# EasyEDA Pro project Cockcroft_Walton PCB.epro

# Board PCB1
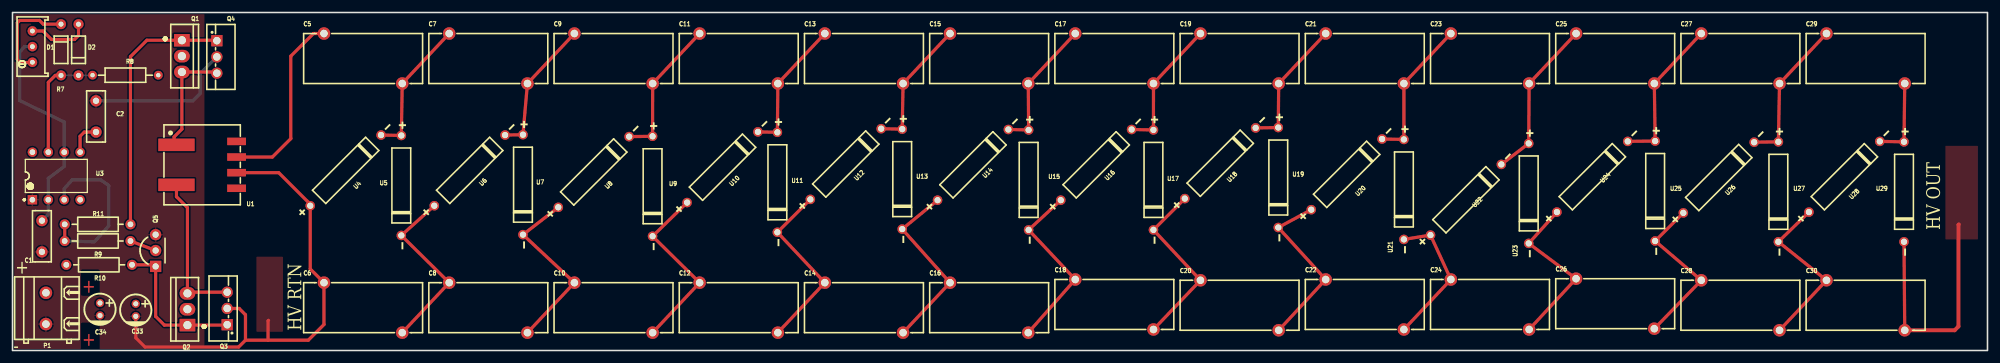
[diagram p0: board, top side]
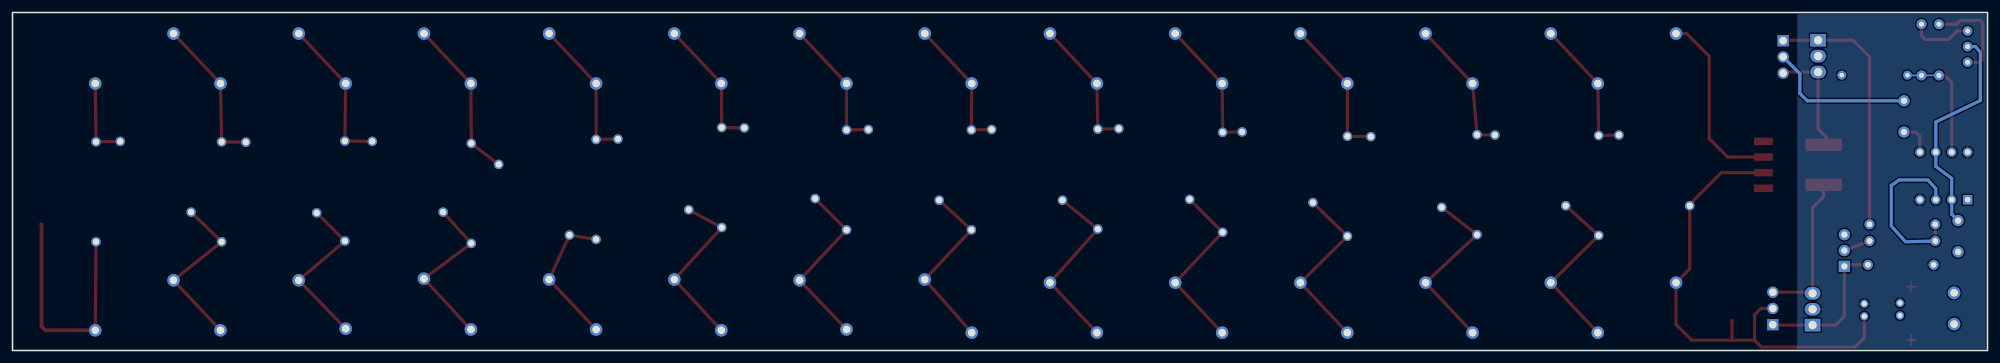
[diagram p1: board, bottom side, seen from below]

Outline 315.47 x 54.1 mm; copper layers: Top Layer, Bottom Layer. Coordinates in mm from the lower left corner of the outline.
Outline path: rectangle 0,54.1 315.47,0
Stack: Top Layer 0.035mm / Dielectric1 1.51mm FR4 er 4.5 / Bottom Layer 0.035mm

## Design rules (mm)
template: JLCPCB Capability(Two Layers Board)
spacing copperThickness1oz (default): track to track 0.102, other pairs 0.152 to 0.3
spacing copperThickness2oz: track to track 0.203, other pairs 0.152 to 0.3
track width copperThickness1oz (default): min 0.127, default 0.254, max 2.54
track width copperThickness2oz: min 0.203, default 0.254, max 2.54
differential pair differentialPair (default): width min 0.127, default 0.254, max 2.54; gap min 0.152, default 0.152
via viaSize (default): diameter min 0.5, default 0.61, max 10; hole min 0.3, default 0.305, max 6.3

## Placement (name value [footprint] x y rotation side)
C1  1nF  [CAP-TH_L8.0-W3.0-P5.0-D0.60]  4.7 18.29 90 top
C2  1nF  [CAP-TH_L8.0-W3.0-P5.0-D0.60]  13.34 37.47 270 top
C5  2nF  [CAP-TH_L19.0-W8.0-P12.50-D0.8-S8.0]  56 46.74 0 top
C6  2nF  [CAP-TH_L19.0-W8.0-P12.50-D0.8-S8.0]  56 6.86 0 top
C7  2nF  [CAP-TH_L19.0-W8.0-P12.50-D0.8-S8.0]  76 46.74 0 top
C8  2nF  [CAP-TH_L19.0-W8.0-P12.50-D0.8-S8.0]  76 6.86 0 top
C9  2nF  [CAP-TH_L19.0-W8.0-P12.50-D0.8-S8.0]  96 46.74 0 top
C10  2nF  [CAP-TH_L19.0-W8.0-P12.50-D0.8-S8.0]  96 6.86 0 top
C11  2nF  [CAP-TH_L19.0-W8.0-P12.50-D0.8-S8.0]  116 46.74 0 top
C12  2nF  [CAP-TH_L19.0-W8.0-P12.50-D0.8-S8.0]  116 6.86 0 top
C13  2nF  [CAP-TH_L19.0-W8.0-P12.50-D0.8-S8.0]  136 46.74 0 top
C14  2nF  [CAP-TH_L19.0-W8.0-P12.50-D0.8-S8.0]  136 6.86 0 top
C15  2nF  [CAP-TH_L19.0-W8.0-P12.50-D0.8-S8.0]  156 46.74 0 top
C16  2nF  [CAP-TH_L19.0-W8.0-P12.50-D0.8-S8.0]  156 6.86 0 top
C17  2nF  [CAP-TH_L19.0-W8.0-P12.50-D0.8-S8.0]  176 46.74 0 top
C18  2nF  [CAP-TH_L19.0-W8.0-P12.50-D0.8-S8.0]  176 7.37 0 top
C19  2nF  [CAP-TH_L19.0-W8.0-P12.50-D0.8-S8.0]  196 46.74 0 top
C20  2nF  [CAP-TH_L19.0-W8.0-P12.50-D0.8-S8.0]  196 7.24 0 top
C21  2nF  [CAP-TH_L19.0-W8.0-P12.50-D0.8-S8.0]  216 46.74 0 top
C22  2nF  [CAP-TH_L19.0-W8.0-P12.50-D0.8-S8.0]  216 7.37 0 top
C23  2nF  [CAP-TH_L19.0-W8.0-P12.50-D0.8-S8.0]  236 46.74 0 top
C24  2nF  [CAP-TH_L19.0-W8.0-P12.50-D0.8-S8.0]  236 7.37 0 top
C25  2nF  [CAP-TH_L19.0-W8.0-P12.50-D0.8-S8.0]  256 46.74 0 top
C26  2nF  [CAP-TH_L19.0-W8.0-P12.50-D0.8-S8.0]  256 7.49 0 top
C27  2nF  [CAP-TH_L19.0-W8.0-P12.50-D0.8-S8.0]  276 46.74 0 top
C28  2nF  [CAP-TH_L19.0-W8.0-P12.50-D0.8-S8.0]  276 7.24 0 top
C29  2nF  [CAP-TH_L19.0-W8.0-P12.50-D0.8-S8.0]  296 46.74 0 top
C30  2nF  [CAP-TH_L19.0-W8.0-P12.50-D0.8-S8.0]  296 7.24 0 top
C33  22uF  [CAP-TH_BD5.0-P2.00-D0.8-FD]  19.69 6.48 270 top
C34  22uF  [CAP-TH_BD5.0-P2.00-D0.8-FD]  13.97 6.6 270 top
D1  1N4148  [DO-35_BD2.0-L4.2-P8.20-D0.5-RD]  7.75 48.13 270 top
D2  1N4148  [DO-35_BD2.0-L4.2-P8.20-D0.5-RD]  10.54 48.13 90 top
P1  WJ128V-5.0-2P  [CONN-TH_2P-P5.00_WJ128V-5.0-2P]  5.33 6.73 90 top
Q1  TIP41C  [TO-220-3_L10.0-W4.5-P2.54-T]  27.05 47.12 0 top
Q2  TIP41C  [TO-220-3_L10.0-W4.5-P2.54-T]  27.94 6.6 180 top
Q3  TIP42C  [ITO-220AB-3_L10.2-W4.5-P2.60-L]  34.29 6.73 90 top
Q4  TIP42C  [ITO-220AB-3_L10.2-W4.5-P2.60-L]  32.64 46.99 270 top
Q5  BC547CTA  [TO-92-3_L4.8-W3.7-P2.54-L]  22.86 16 90 top
R7  10kΩ  [RES-ADJ-TH_3P-L10.0-W10.0-P2.50-L]  3.17 48.64 90 top
R8  1kΩ  [RES-TH_BD2.3-L6.5-P10.50-D0.5]  18.03 44.07 0 top
R9  5.1kΩ  [RES-TH_BD2.2-L6.5-P10.50-D0.6]  13.59 17.53 0 top
R10  5.1kΩ  [RES-TH_BD2.2-L6.5-P10.50-D0.6]  13.84 13.72 180 top
R11  2kΩ  [RES-TH_BD2.2-L6.5-P10.50-D0.6]  13.59 20.19 0 top
U1  FC-SCT1010-1:200T-40A  [XFMR-SMD_6P-P2.50_FC-SCT1010]  30.99 29.72 180 top
U3  100kHz  [DIP-8_L9.8-W6.6-P2.54-LS7.6-BL]  6.98 27.94 0 top
U4  2CL77  [DIO-TH_BD3.0-L12.0-P16.00-D0.6]  53.21 28.83 225 top
U5  2CL77  [DIO-TH_BD3.0-L12.0-P16.00-D0.6]  62.1 26.42 90 top
U6  2CL77  [DIO-TH_BD3.0-L12.0-P16.00-D0.6]  73.03 28.83 225 top
U7  2CL77  [DIO-TH_BD3.0-L12.0-P16.00-D0.6]  81.53 26.54 90 top
U8  2CL77  [DIO-TH_BD3.0-L12.0-P16.00-D0.6]  92.84 28.58 225 top
U9  2CL77  [DIO-TH_BD3.0-L12.0-P16.00-D0.6]  102.23 26.29 90 top
U10  2CL77  [DIO-TH_BD3.0-L12.0-P16.00-D0.6]  113.41 29.34 225 top
U11  2CL77  [DIO-TH_BD3.0-L12.0-P16.00-D0.6]  122.17 26.92 90 top
U12  2CL77  [DIO-TH_BD3.0-L12.0-P16.00-D0.6]  133.1 29.84 225 top
U13  2CL77  [DIO-TH_BD3.0-L12.0-P16.00-D0.6]  142.11 27.43 90 top
U14  2CL77  [DIO-TH_BD3.0-L12.0-P16.00-D0.6]  153.42 29.72 225 top
U15  2CL77  [DIO-TH_BD3.0-L12.0-P16.00-D0.6]  162.31 27.31 90 top
U16  2CL77  [DIO-TH_BD3.0-L12.0-P16.00-D0.6]  173.1 29.72 225 top
U17  2CL77  [DIO-TH_BD3.0-L12.0-P16.00-D0.6]  182.25 27.31 90 top
U18  2CL77  [DIO-TH_BD3.0-L12.0-P16.00-D0.6]  192.91 29.97 225 top
U19  2CL77  [DIO-TH_BD3.0-L12.0-P16.00-D0.6]  202.18 27.69 90 top
U20  2CL77  [DIO-TH_BD3.0-L12.0-P16.00-D0.6]  213.11 28.19 225 top
U21  2CL77  [DIO-TH_BD3.0-L12.0-P16.00-D0.6]  222.25 25.78 90 top
U22  2CL77  [DIO-TH_BD3.0-L12.0-P16.00-D0.6]  232.16 24.13 225 top
U23  2CL77  [DIO-TH_BD3.0-L12.0-P16.00-D0.6]  242.19 25.15 90 top
U24  2CL77  [DIO-TH_BD3.0-L12.0-P16.00-D0.6]  252.35 27.81 225 top
U25  2CL77  [DIO-TH_BD3.0-L12.0-P16.00-D0.6]  262.38 25.53 90 top
U26  2CL77  [DIO-TH_BD3.0-L12.0-P16.00-D0.6]  272.54 27.69 225 top
U27  2CL77  [DIO-TH_BD3.0-L12.0-P16.00-D0.6]  282.07 25.4 90 top
U28  2CL77  [DIO-TH_BD3.0-L12.0-P16.00-D0.6]  292.61 27.81 225 top
U29  2CL77  [DIO-TH_BD3.0-L12.0-P16.00-D0.6]  302.13 25.4 90 top

## Footprints (pads in the part's own frame, mm; a bottom-side part is the same pattern mirrored in y, then rotated)
CAP-TH_BD5.0-P2.00-D0.8-FD
  round 1.3 hole 0.8: 1(-1,0) 2(1,0)
CAP-TH_L8.0-W3.0-P5.0-D0.60
  round 1.8 hole 1: 1(-2.5,0) 2(2.5,0)
CAP-TH_L19.0-W8.0-P12.50-D0.8-S8.0
  round 2 hole 1.2: 1(-6.25,4) 2(6.25,-4)
CONN-TH_2P-P5.00_WJ128V-5.0-2P
  round 2 hole 1.2: 1(-2.505,0) 2(2.505,0)
DIO-TH_BD3.0-L12.0-P16.00-D0.6
  round 1.524 hole 1: 1(-8,0) 2(8,0)
DIP-8_L9.8-W6.6-P2.54-LS7.6-BL
  rect 1.5x1.5 hole 0.9: 1(-3.81,-3.81)
  round 1.5 hole 0.9: 2(-1.27,-3.81) 3(1.27,-3.81) 4(3.81,-3.81) 5(3.81,3.81) 6(1.27,3.81) 7(-1.27,3.81) 8(-3.81,3.81)
DO-35_BD2.0-L4.2-P8.20-D0.5-RD
  round 1.6 hole 0.8: 1(-4.1,0) 2(4.1,0)
ITO-220AB-3_L10.2-W4.5-P2.60-L
  rect 1.8x1.8 hole 1.2: 1(-2.6,0)
  round 1.8 hole 1.2: 2(0,0) 3(2.6,0)
RES-ADJ-TH_3P-L10.0-W10.0-P2.50-L
  round 1.524 hole 0.762: 1(-2.5,0) 2(0,0) 3(2.5,0)
RES-TH_BD2.2-L6.5-P10.50-D0.6
  round 1.6 hole 0.914: 1(-5.25,0) 2(5.25,0)
RES-TH_BD2.3-L6.5-P10.50-D0.5
  round 1.4 hole 0.7: 1(-5.25,0) 2(5.25,0)
TO-92-3_L4.8-W3.7-P2.54-L
  rect 1.8x1.8 hole 1: 1(-2.54,0)
  round 1.8 hole 1: 2(0,0) 3(2.54,0)
TO-220-3_L10.0-W4.5-P2.54-T
  rect 2.5x2 hole 1.3: 1(0,2.54)
  oval 2.5x2 hole 1.3: 2(0,0) 3(0,-2.54)
XFMR-SMD_6P-P2.50_FC-SCT1010
  rect 5.8x2 smd: 1(4.8,-3.2) 2(4.8,3.2)
  rect 3x1.2 smd: 3(-4.8,3.75) 4(-4.8,1.25) 5(-4.8,-1.25) 6(-4.8,-3.75)

## Nets
GND: C1.1 C2.1 C6.1 C33.2 C34.2 P1.1 Q3.2 Q4.2 Q5.3 U1.4 U3.1 U4.2
VCC: C33.1 C34.1 P1.2 Q1.2 Q2.2 R8.2 R10.2 U3.4 U3.8
NET5: C29.2 U28.1 U29.2
TRIG: C1.2 R7.2 U3.2 U3.6
$1N872: Q2.3 Q3.3 U1.2
$1N998: Q1.3 Q4.3 U1.1
$1N1038: Q2.1 Q3.1 Q5.1 R10.1
$1N1044: Q1.1 Q4.1 R11.2
$1N1125: Q5.2 R9.2
$1N1129: R9.1 R11.1 U3.3
$1N1691: D2.2 R7.3
$1N1693: D1.1 R7.1
$1N1749: C2.2 U3.5
$1N1755: D1.2 D2.1 R8.1 U3.7
$1N2141: C5.2 C7.1 U4.1 U5.2
$1N2190: C6.2 C8.1 U5.1 U6.2
$1N2475: C7.2 C9.1 U6.1 U7.2
$1N2479: C8.2 C10.1 U7.1 U8.2
$1N2619: C9.2 C11.1 U8.1 U9.2
$1N2623: C10.2 C12.1 U9.1 U10.2
$1N2763: C11.2 C13.1 U10.1 U11.2
$1N2767: C12.2 C14.1 U11.1 U12.2
$1N2907: C13.2 C15.1 U12.1 U13.2
$1N2911: C14.2 C16.1 U13.1 U14.2
$1N3051: C15.2 C17.1 U14.1 U15.2
$1N3055: C16.2 C18.1 U15.1 U16.2
$1N3195: C17.2 C19.1 U16.1 U17.2
$1N3199: C18.2 C20.1 U17.1 U18.2
$1N3339: C19.2 C21.1 U18.1 U19.2
$1N3343: C20.2 C22.1 U19.1 U20.2
$1N3631: C24.2 C26.1 U23.1 U24.2
$1N3775: C26.2 C28.1 U25.1 U26.2
$1N3919: C28.2 C30.1 U27.1 U28.2
$1N4063: C30.2 U29.1
$1N4211: C25.2 C27.1 U24.1 U25.2
$1N4214: C27.2 C29.1 U26.1 U27.2
$1N4243: C22.2 C24.1 U21.1 U22.2
$1N4268: C21.2 C23.1 U20.1 U21.2
$1N4271: C23.2 C25.1 U22.1 U23.2
$1N4334: C5.1 U1.5

Pads without a net: U1 3 6

## Routing (per net, layer and track width the routed paths; a pad name or vN(x,y) marks a point on that pad's centre or on a via; arc(x,y) is an arc through that point)
GND: length 104.3
  Top Layer w0.508: C33.2 19.69,2.03 21.16,0.55 36.11,0.55 37.21,1.65 ; 37.21,1.65 40.82,1.65 ; 37.21,1.65 37.21,5.72 36.2,6.73 Q3.2 ; 40.89,4.83 40.82,4.75 40.82,1.65 ; U1.4 42.51,28.47 47.56,23.43 U4.2 47.56,13.05 C6.1 49.75,4.16 47.24,1.65 40.82,1.65
  Bottom Layer w0.508: C2.1 28.79,39.97 29.97,41.15 29.97,44.32 Q4.2
NET5: length 13.2
  Top Layer w0.508: C29.2 U29.2 U28.1
TRIG: length 35.6
  Bottom Layer w0.508: R7.2 1.9,48.64 1.14,47.75 1.14,40.01 8.25,36.58 U3.6 8.25,29.46 5.71,27.56 U3.2 5.71,21.8 C1.2
$1N872: length 24.5
  Top Layer w0.508: U1.2 26.19,24.61 27.94,22.86 Q2.3 28.13,9.33 Q3.3
$1N998: length 18
  Top Layer w0.508: Q4.3 32.45,44.58 Q1.3 27.05,35.43 25.81,34.19 25.81,33.3 U1.1
$1N1038: length 23.9
  Top Layer w0.508: R10.1 22.61,13.72 Q5.1 22.86,5.46 24.26,4.06 Q2.1 34.22,4.06 Q3.1
$1N1044: length 41.8
  Top Layer w0.508: Q4.1 32.57,49.66 Q1.1 21.46,49.66 18.84,47.03 R11.2
$1N1125: length 4.3
  Top Layer w0.508: Q5.2 R9.2
$1N1129: length 27.1
  Top Layer w0.508: R9.1 R11.1
  Bottom Layer w0.508: U3.3 8.25,25.91 9.53,27.31 14.1,27.31 15.37,26.42 15.37,19.94 13.08,17.4 R9.1
$1N1691: length 10
  Top Layer w0.508: R7.3 4.87,51.14 6.22,49.78 9.91,49.78 10.54,50.42 10.54,52.23
$1N1693: length 15.9
  Top Layer w0.508: 7.75,52.23 4.92,52.23 4.32,52.83 1.14,52.83 0.76,52.45 0.76,46.61 1.27,46.1 3.13,46.1 R7.1
$1N1749: length 5.4
  Top Layer w0.508: C2.2 11.47,34.97 10.79,34.29 10.79,31.75
$1N1755: length 18.7
  Top Layer w0.508: D1.2 6.82,44.03 5.71,42.93 U3.7
  Bottom Layer w0.254: D1.2 D2.1 12.75,44.03 R8.1
$1N2141: length 22.5
  Top Layer w0.508: U4.1 U5.2 C5.2 C7.1
$1N2190: length 28.8
  Top Layer w0.508: C6.2 C8.1 U5.1 U6.2
$1N2475: length 22
  Top Layer w0.508: C9.1 C7.2 U7.2 U6.1
$1N2479: length 29.4
  Top Layer w0.508: U8.2 U7.1 C10.1 C8.2
$1N2619: length 23.2
  Top Layer w0.508: U8.1 U9.2 C9.2 C11.1
$1N2623: length 29.3
  Top Layer w0.508: U10.2 U9.1 C12.1 C10.2
$1N2763: length 21.9
  Top Layer w0.508: C13.1 C11.2 U11.2 U10.1
$1N2767: length 29.5
  Top Layer w0.508: U12.2 U11.1 C14.1 C12.2
$1N2907: length 21.6
  Top Layer w0.508: C15.1 C13.2 U13.2 U12.1
$1N2911: length 29.8
  Top Layer w0.508: U14.2 U13.1 C16.1 C14.2
$1N3051: length 21.6
  Top Layer w0.508: U14.1 U15.2 C15.2 C17.1
$1N3055: length 29.2
  Top Layer w0.508: U16.2 U15.1 C18.1 C16.2
$1N3195: length 21.9
  Top Layer w0.508: C19.1 C17.2 U17.2 U16.1
$1N3199: length 29
  Top Layer w0.508: C18.2 C20.1 U17.1 187.26,24.31
$1N3339: length 21.6
  Top Layer w0.508: 198.57,35.63 U19.2 C19.2 C21.1
$1N3343: length 28.3
  Top Layer w0.508: 207.45,22.54 U19.1 C22.1 C20.2
$1N3631: length 27.2
  Top Layer w0.508: C24.2 C26.1 U23.1 U24.2
$1N3775: length 26.8
  Top Layer w0.508: 262.25,3.49 C28.1 U25.1 266.88,22.03
$1N3919: length 27.6
  Top Layer w0.508: U28.2 U27.1 C30.1 C28.2
$1N4063: length 39.4
  Top Layer w0.508: C30.2 U29.1
  Top Layer w0.61: 310.9,20.19 310.83,20.13 310.83,3.85 310.22,3.24 C30.2
$1N4211: length 24.6
  Top Layer w0.508: C27.1 C25.2 U25.2 U24.1
$1N4214: length 24.2
  Top Layer w0.508: 278.2,33.34 U27.2 C27.2 C29.1
$1N4243: length 23.1
  Top Layer w0.508: C22.2 C24.1 U22.2 U21.1
$1N4268: length 23.4
  Top Layer w0.508: C23.1 C21.2 U21.2 218.76,33.85
$1N4271: length 26.1
  Top Layer w0.508: U22.1 U23.2 C23.2 C25.1
$1N4334: length 29.9
  Top Layer w0.508: C5.1 48.07,50.74 44.45,47.12 44.45,33.91 41.51,30.97 U1.5

## Copper pours and planes (outline as drawn; the poured copper is in the pictures)
GND on Top Layer: 0,54.1 30.65,54.1 30.65,0 0,0
GND on Top Layer: 38.99,14.99 43.18,14.99 43.18,3.05 38.99,3.05
GND on Top Layer: 38.99,14.99 43.18,14.99 43.18,3.05 38.99,3.05
VCC on Bottom Layer: -0.25,54.1 30.39,54.1 30.39,0 -0.25,0
$1N4063 on Top Layer: 308.74,32.77 313.94,32.77 313.94,17.78 308.74,17.78

Small or netless copper shapes (teardrops, artwork), in the pictures only: 1 on Top Layer

## Text on the board
Top Layer: +
Top Silkscreen Layer: - | + | HV RTN | HV OUT
